# EasyEDA schematic DW_RTK_PCB_Schematic_EasyEDA.json
TITLE: Sheet_1; REV: 1.0; Date: 2024-05-18; Sheet: 1/1; Drawn By: geobenedict; Company: UWA
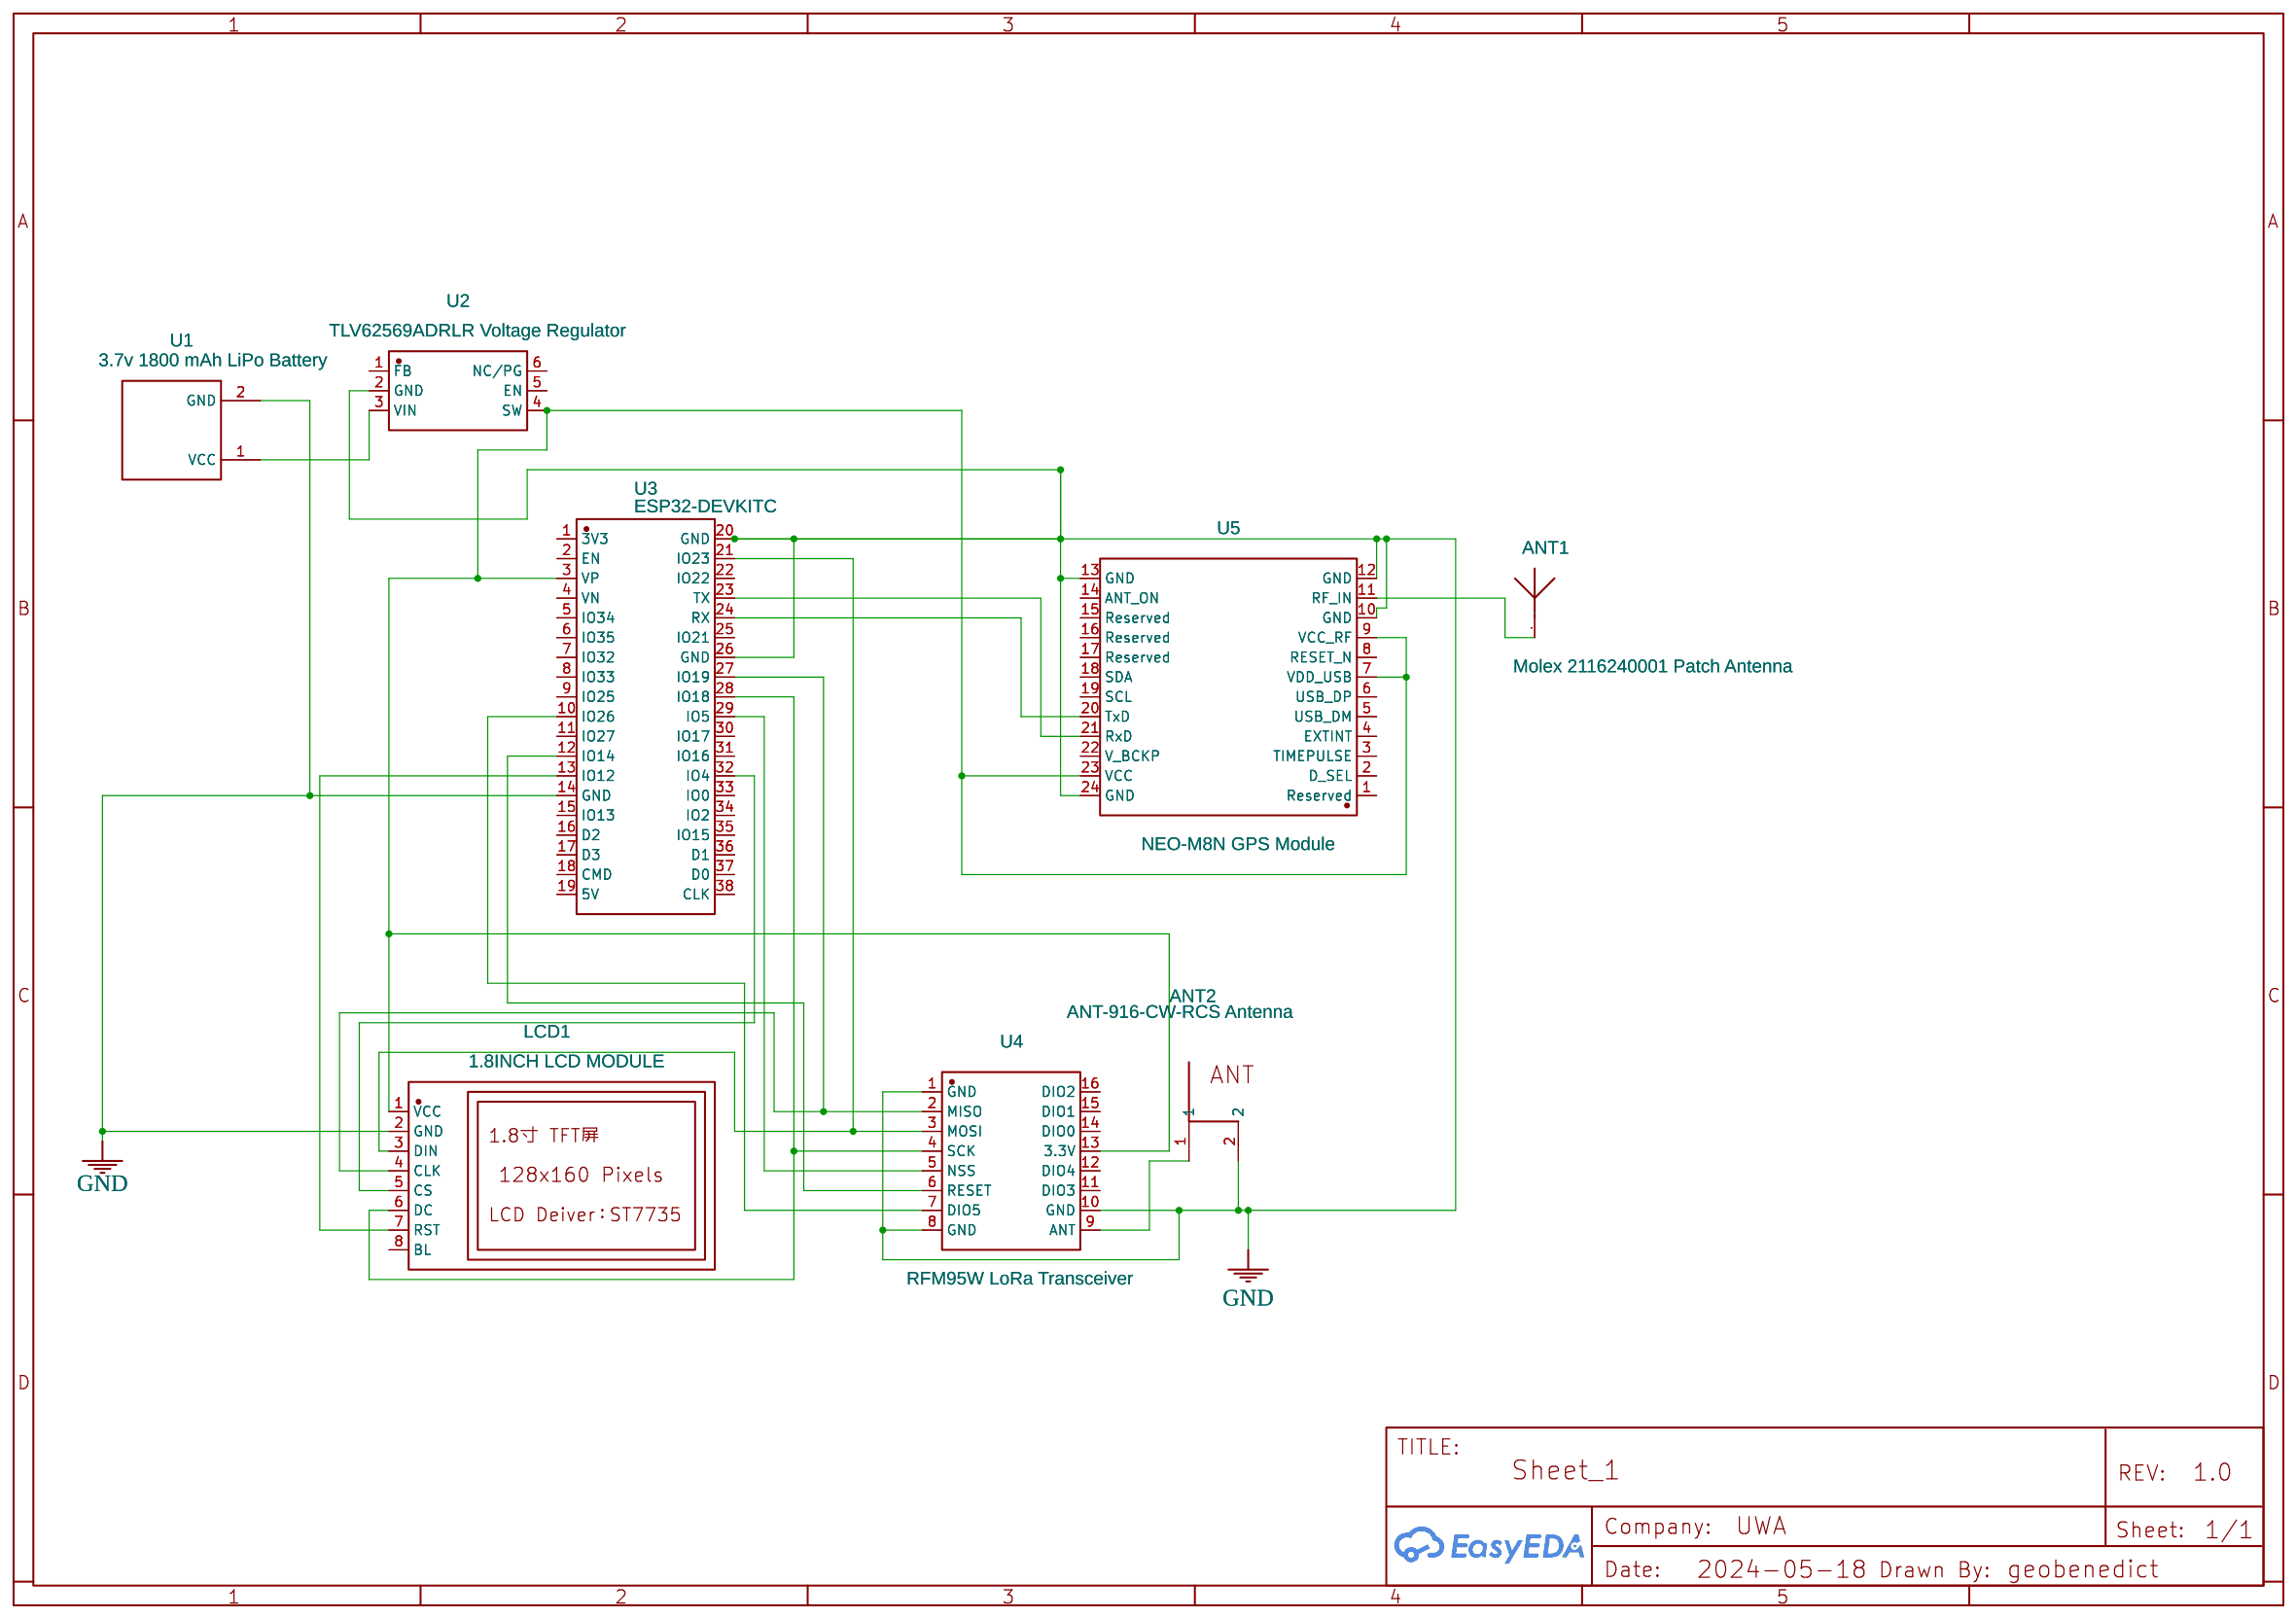
[diagram p0: schematic sheet]

## Parts
ANT1  Molex 2116240001 Patch Antenna  [GPS-TH_L18.4-W18.4_YG0008AA]
ANT2  ANT-916-CW-RCS Antenna  [ANT-915-USP410]
LCD1  1.8INCH LCD MODULE  [LCD-TH_L56.5-W34.0_1-8INCH-LCD-MODULE]
U1  3.7v 1800 mAh LiPo Battery  [3.7V 1800 MAH LIPO]
U2  TLV62569ADRLR Voltage Regulator  [SOT-563_L1.6-W1.2-P0.50-LS1.6-BL]
U3  ESP32-DEVKITC  [BULETM-SMD_ESP32-DEVKITC]
U4  RFM95W LoRa Transceiver  [COMM-SMD_RFM95W]
U5  NEO-M8N GPS Module  [GPSM-SMD_NEO-M8N]

## Library data of the parts
ANT1 = YG0005AA: Supplier: LCSC; Supplier Part: C3292969; Manufacturer: Quectel(移远); Contributor: lcsc; JLCPCB Part Class: Extended Part
ANT2 = LINX ANTENNA USP410: Manufacturer: Linx; Contributor: Jayven
LCD1 = 1.8INCH LCD MODULE: Supplier: LCSC; Supplier Part: C359940; Manufacturer: Waveshare(微雪电子); Manufacturer Part: 1.8inch LCD Module; JLCPCB Part Class: Extended Part; Contributor: lcsc
U1 = 3.7v 1800 mAh LiPo: Supplier Part: 804040; link: https://www.aliexpress.com/item/3256803961495200.html?spm=a2g0o.order_list.0.0.5de51802NEwHKe; Contributor: rainbowpcb
U2 = TLV62569ADRLR: Contributor: LCSC; Supplier: LCSC; Supplier Part: C398367; Manufacturer: TI(德州仪器); JLCPCB Part Class: Extended Part
U3 = ESP32-DEVKITC: Supplier: LCSC; Supplier Part: C571180; Manufacturer: ESPRESSIF(乐鑫); Manufacturer Part: ESP32-DevKitC; Contributor: lcsc; JLCPCB Part Class: Extended Part
U4 = RFM95W: Contributor: LCSC; Supplier: LCSC; Supplier Part: C9900000484; JLCPCB Part Class: Extended Part; Manufacturer: null
U5 = NEO-M8N: Contributor: LCSC; Supplier: LCSC; Supplier Part: C9900011924; Manufacturer: null; JLCPCB Part Class: Extended Part

## Nets
GND: ANT2.2 LCD1.2(GND) U1.2(GND) U2.2(GND) U3.14(GND) U3.20(GND) U3.26(GND) U4.1(GND) U4.8(GND) U4.10(GND) U5.10(GND) U5.12(GND) U5.13(GND) U5.24(GND)
Net-(ANT1-1): ANT1.1 U5.11(RF_IN)
Net-(ANT2-1): ANT2.1 U4.9(ANT)
Net-(LCD1-1): LCD1.1(VCC) U2.4(SW) U3.3(VP) U4.13(3.3V) U5.7(VDD_USB) U5.9(VCC_RF) U5.23(VCC)
Net-(LCD1-3): LCD1.3(DIN) U3.21(IO23) U4.3(MOSI)
Net-(LCD1-4): LCD1.4(CLK) U3.27(IO19) U4.2(MISO)
Net-(LCD1-5): LCD1.5(CS) U3.32(IO4)
Net-(LCD1-6): LCD1.6(DC) U3.28(IO18) U4.4(SCK)
Net-(LCD1-7): LCD1.7(RST) U3.13(IO12)
Net-(U1-1): U1.1(VCC) U2.3(VIN)
Net-(U3-10): U3.10(IO26) U4.7(DIO5)
Net-(U3-12): U3.12(IO14) U4.6(RESET)
Net-(U3-23): U3.23(TX) U5.21(RxD)
Net-(U3-24): U3.24(RX) U5.20(TxD)
Net-(U3-29): U3.29(IO5) U4.5(NSS)

Not connected (* = marked no-connect by the designer): LCD1 8(BL); U2 1(FB) 5(EN) 6(NC/PG); U3 1(3V3) 2(EN) 4(VN) 5(IO34) 6(IO35) 7(IO32) 8(IO33) 9(IO25) 11(IO27) 15(IO13) 16(D2) 17(D3) 18(CMD) 19(5V) 22(IO22) 25(IO21) 30(IO17) 31(IO16) 33(IO0) 34(IO2) 35(IO15) 36(D1) 37(D0) 38(CLK); U4 11(DIO3) 12(DIO4) 14(DIO0) 15(DIO1) 16(DIO2); U5 1(Reserved) 2(D_SEL) 3(TIMEPULSE) 4(EXTINT) 5(USB_DM) 6(USB_DP) 8(RESET_N) 14(ANT_ON) 15(Reserved) 16(Reserved) 17(Reserved) 18(SDA) 19(SCL) 22(V_BCKP)
